# EAGLE schematic reaction_wheel_board (EAGLE 8.4.1)
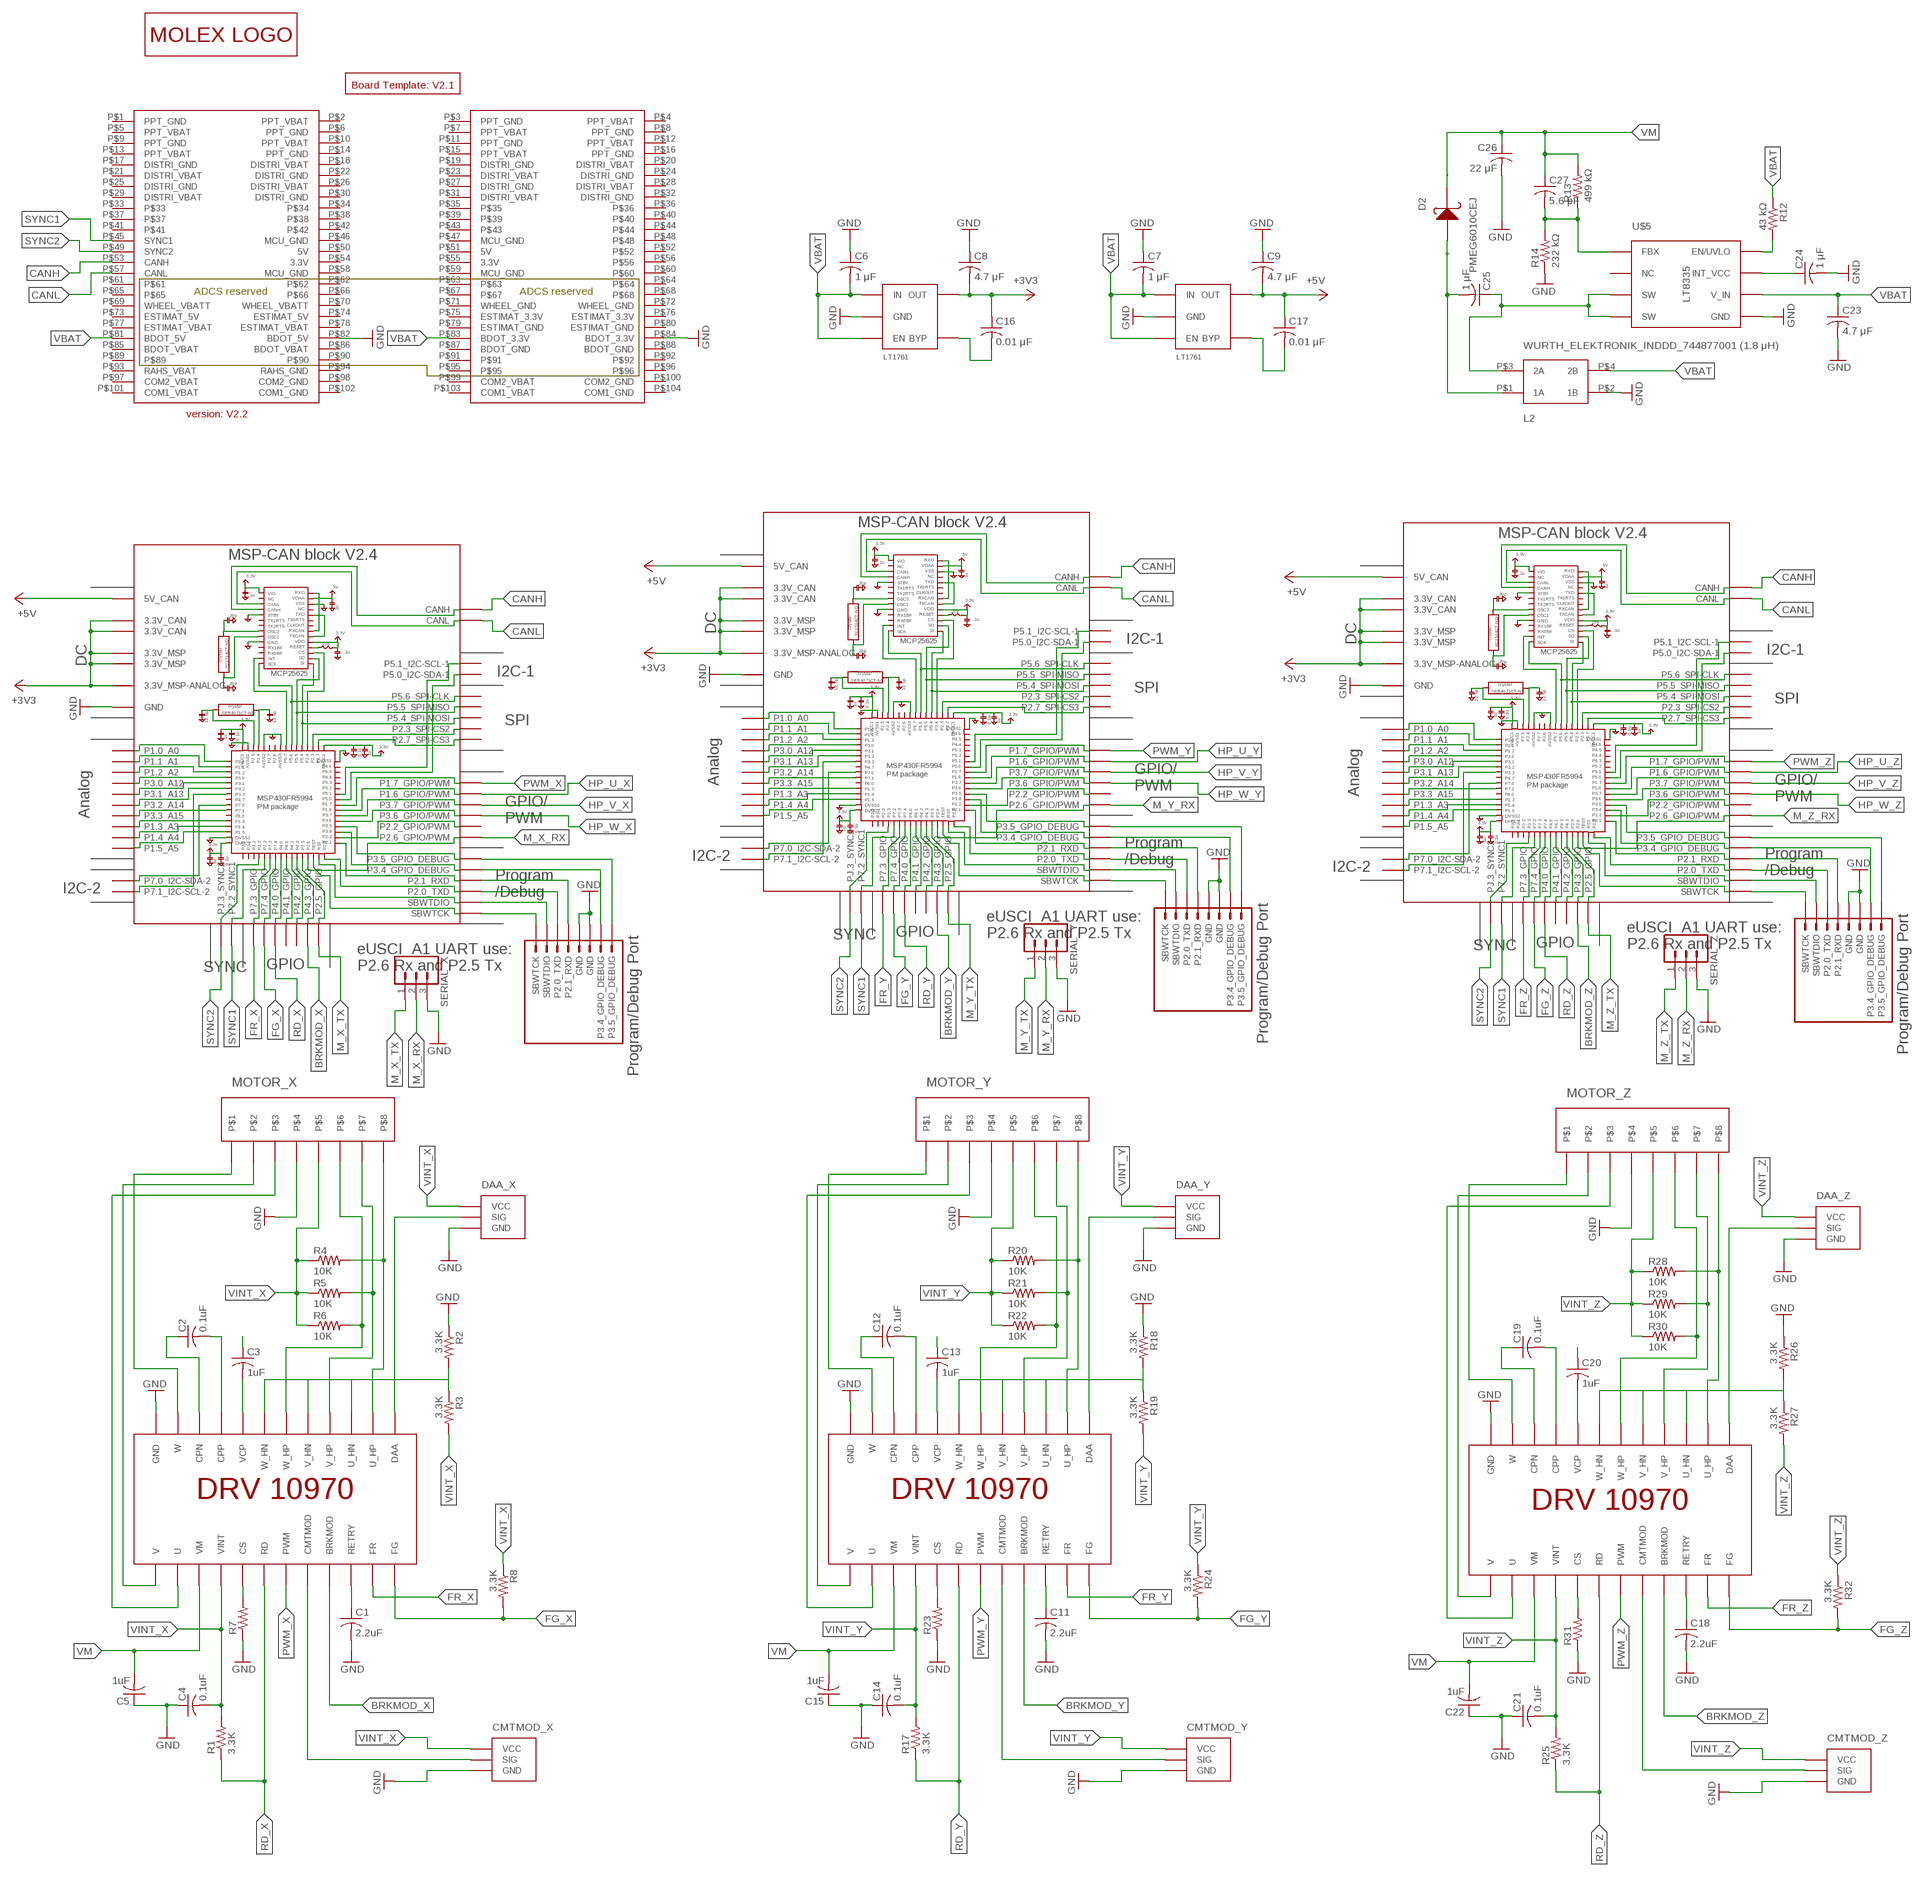
[diagram p0: schematic, sheet 1]

## Parts
C1  2.2uF  C-USC1206  [C1206]
C2  0.1uF  C-USC0805  [C0805]
C3  1uF  C-USC1206  [C1206]
C4  0.1uF  C-USC0805  [C0805]
C5  1uF  C-USC1206  [C1206]
C6  1 μF  C-USC0805  [C0805]
C7  1 μF  C-USC0805  [C0805]
C8  4.7 μF  C-USC0805  [C0805]
C9  4.7 μF  C-USC0805  [C0805]
C11  2.2uF  C-USC1206  [C1206]
C12  0.1uF  C-USC0805  [C0805]
C13  1uF  C-USC1206  [C1206]
C14  0.1uF  C-USC0805  [C0805]
C15  1uF  C-USC1206  [C1206]
C16  0.01 μF  C-USC0805  [C0805]
C17  0.01 μF  C-USC0805  [C0805]
C18  2.2uF  C-USC1206  [C1206]
C19  0.1uF  C-USC0805  [C0805]
C20  1uF  C-USC1206  [C1206]
C21  0.1uF  C-USC0805  [C0805]
C22  1uF  C-USC1206  [C1206]
C23  4.7 μF  C-USC0805  [C0805]
C24  1 μF  C-USC0805  [C0805]
C25  1 μF  C-USC0805  [C0805]
C26  22 μF  C-USC0805  [C0805]
C27  5.6 pF  C-USC0805  [C0805]
CMTMOD_X  0_OHM_JUMPER  [0_OHM_JUMPER]
CMTMOD_Y  0_OHM_JUMPER  [0_OHM_JUMPER]
CMTMOD_Z  0_OHM_JUMPER  [0_OHM_JUMPER]
D2  PMEG6010CEJ  [SC-90]
DAA_X  0_OHM_JUMPER  [0_OHM_JUMPER]
DAA_Y  0_OHM_JUMPER  [0_OHM_JUMPER]
DAA_Z  0_OHM_JUMPER  [0_OHM_JUMPER]
L2  WURTH_ELEKTRONIK_INDDD_744877001 (1.8 μH)  WURTH_ELEKTRONIK_INDDD_744877001  [WURTH_ELEKTRONIK_INDDD_744877001]
LDO_3V3  LINEAR_LDO_LT1761-X  [SOT-23-5]
LDO_5V  LINEAR_LDO_LT1761-X  [SOT-23-5]
MOTOR_X  PICOLOCK_8  [PICOLOCK_8]
MOTOR_Y  PICOLOCK_8  [PICOLOCK_8]
MOTOR_Z  PICOLOCK_8  [PICOLOCK_8]
R1  3.3K  R-US_R0805  [R0805]
R2  3.3K  R-US_R0805  [R0805]
R3  3.3K  R-US_R0805  [R0805]
R4  10K  R-US_R0805  [R0805]
R5  10K  R-US_R0805  [R0805]
R6  10K  R-US_R0805  [R0805]
R7  R-US_R0805  [R0805]
R8  3.3K  R-US_R0805  [R0805]
R12  43 kΩ  R-US_R0805  [R0805]
R13  499 kΩ  R-US_R0805  [R0805]
R14  232 kΩ  R-US_R0805  [R0805]
R17  3.3K  R-US_R0805  [R0805]
R18  3.3K  R-US_R0805  [R0805]
R19  3.3K  R-US_R0805  [R0805]
R20  10K  R-US_R0805  [R0805]
R21  10K  R-US_R0805  [R0805]
R22  10K  R-US_R0805  [R0805]
R23  R-US_R0805  [R0805]
R24  3.3K  R-US_R0805  [R0805]
R25  3.3K  R-US_R0805  [R0805]
R26  3.3K  R-US_R0805  [R0805]
R27  3.3K  R-US_R0805  [R0805]
R28  10K  R-US_R0805  [R0805]
R29  10K  R-US_R0805  [R0805]
R30  10K  R-US_R0805  [R0805]
R31  R-US_R0805  [R0805]
R32  3.3K  R-US_R0805  [R0805]
SERIAL_X  CONN_03LOCK  [1X03_LOCK]
SERIAL_Y  CONN_03LOCK  [1X03_LOCK]
SERIAL_Z  CONN_03LOCK  [1X03_LOCK]
U$1  BOARD_TEMPLATE  [BOARD_TEMPLATE]
U$2  PC104_CONNECTOR  [PC104_CONNECTOR]
U$3  MSP-CAN_BLOCK  [MSP-CAN_BLOCK]
U$4  PROGRAM/DEBUG_PORT  [1X08_CONNECTOR]
U$5  LT8335  [DDB]
U$7  DRV10970  [DRV10970]
U$8  LOGO_MOLEX  [LOGO_MOLEX]
U$10  MSP-CAN_BLOCK  [MSP-CAN_BLOCK]
U$11  PROGRAM/DEBUG_PORT  [1X08_CONNECTOR]
U$12  DRV10970  [DRV10970]
U$13  MSP-CAN_BLOCK  [MSP-CAN_BLOCK]
U$14  PROGRAM/DEBUG_PORT  [1X08_CONNECTOR]
U$15  DRV10970  [DRV10970]

## Nets
+3V3: C8.2 C16.1 LDO_3V3.P$5(OUT) U$3.3.3V@CAN1(3.3V_CAN) U$3.3.3V@CAN2(3.3V_CAN) U$3.3.3V@MSP1(3.3V_MSP) U$3.3.3V@MSP2(3.3V_MSP) U$3.3.3V_ANALOG@MSP2(3.3V_MSP-ANALOG) U$10.3.3V@CAN1(3.3V_CAN) U$10.3.3V@CAN2(3.3V_CAN) U$10.3.3V@MSP1(3.3V_MSP) U$10.3.3V@MSP2(3.3V_MSP) U$10.3.3V_ANALOG@MSP2(3.3V_MSP-ANALOG) U$13.3.3V@CAN1(3.3V_CAN) U$13.3.3V@CAN2(3.3V_CAN) U$13.3.3V@MSP1(3.3V_MSP) U$13.3.3V@MSP2(3.3V_MSP) U$13.3.3V_ANALOG@MSP2(3.3V_MSP-ANALOG)
+5V: C9.2 C17.1 LDO_5V.P$5(OUT) U$3.5V(5V_CAN) U$10.5V(5V_CAN) U$13.5V(5V_CAN)
BRKMOD_X: U$3.P4.3_GPIO U$7.BRKMOD
BRKMOD_Y: U$10.P4.3_GPIO U$12.BRKMOD
BRKMOD_Z: U$13.P4.3_GPIO U$15.BRKMOD
CANH: U$2.P$53(CANH) U$3.CANH U$10.CANH U$13.CANH
CANL: U$2.P$57(CANL) U$3.CANL U$10.CANL U$13.CANL
CMTMOD_X: CMTMOD_X.P$2(SIG) U$7.CMTMOD
CMTMOD_Y: CMTMOD_Y.P$2(SIG) U$12.CMTMOD
CMTMOD_Z: CMTMOD_Z.P$2(SIG) U$15.CMTMOD
CPN_X: C2.1 U$7.CPN
CPN_Y: C12.1 U$12.CPN
CPN_Z: C19.1 U$15.CPN
CPP_X: C2.2 U$7.CPP
CPP_Y: C12.2 U$12.CPP
CPP_Z: C19.2 U$15.CPP
CS_X: R7.2 U$7.CS
CS_Y: R23.2 U$12.CS
CS_Z: R31.2 U$15.CS
DAA_X: DAA_X.P$2(SIG) U$7.DAA
DAA_Y: DAA_Y.P$2(SIG) U$12.DAA
DAA_Z: DAA_Z.P$2(SIG) U$15.DAA
EN_UVLO: R12.2 U$5.P$8(EN/UVLO)
FBX: C27.2 R13.1 R14.2 U$5.P$1(FBX)
FG_X: R8.2 U$3.P7.4_GPIO U$7.FG
FG_Y: R24.2 U$10.P7.4_GPIO U$12.FG
FG_Z: R32.2 U$13.P7.4_GPIO U$15.FG
FR_X: U$3.P7.3_GPIO U$7.FR
FR_Y: U$10.P7.3_GPIO U$12.FR
FR_Z: U$13.P7.3_GPIO U$15.FR
GND: C1.2 C3.1 C4.1 C5.1 C6.1 C7.1 C8.1 C9.1 C11.2 C13.1 C14.1 C15.1 C18.2 C20.1 C21.1 C22.1 C23.2 C24.2 C26.2 CMTMOD_X.P$1(GND) CMTMOD_Y.P$1(GND) CMTMOD_Z.P$1(GND) DAA_X.P$1(GND) DAA_Y.P$1(GND) DAA_Z.P$1(GND) L2.P$2(1B) LDO_3V3.P$2(GND) LDO_5V.P$2(GND) MOTOR_X.P$4 MOTOR_Y.P$4 MOTOR_Z.P$4 R2.1 R7.1 R14.1 R18.1 R23.1 R26.1 R31.1 SERIAL_X.3 SERIAL_Y.3 SERIAL_Z.3 U$2.P$82(BDOT_5V) U$2.P$84(BDOT_3.3V) U$3.GND@1(GND) U$3.GND@2(GND) U$3.GND@3(GND) U$3.GND@4(GND) U$3.GND@5(GND) U$3.GND@7(GND) U$3.GND@8(GND) U$3.GND@9(GND) U$3.GND@10(GND) U$3.GND@11(GND) U$3.GND@12(GND) U$3.GND@13(GND) U$3.GND@14(GND) U$3.GND@15(GND) U$3.GND@16(GND) U$3.GND@17(GND) U$3.GND@26(GND) U$4.5(GND) U$4.6(GND) U$5.GND U$5.P$5(GND) U$7.GND@1(GND) U$7.GND@2(GND) U$10.GND@1(GND) U$10.GND@2(GND) U$10.GND@3(GND) U$10.GND@4(GND) U$10.GND@5(GND) U$10.GND@7(GND) U$10.GND@8(GND) U$10.GND@9(GND) U$10.GND@10(GND) U$10.GND@11(GND) U$10.GND@12(GND) U$10.GND@13(GND) U$10.GND@14(GND) U$10.GND@15(GND) U$10.GND@16(GND) U$10.GND@17(GND) U$10.GND@26(GND) U$11.5(GND) U$11.6(GND) U$12.GND@1(GND) U$12.GND@2(GND) U$13.GND@1(GND) U$13.GND@2(GND) U$13.GND@3(GND) U$13.GND@4(GND) U$13.GND@5(GND) U$13.GND@7(GND) U$13.GND@8(GND) U$13.GND@9(GND) U$13.GND@10(GND) U$13.GND@11(GND) U$13.GND@12(GND) U$13.GND@13(GND) U$13.GND@14(GND) U$13.GND@15(GND) U$13.GND@16(GND) U$13.GND@17(GND) U$13.GND@26(GND) U$14.5(GND) U$14.6(GND) U$15.GND@1(GND) U$15.GND@2(GND)
GPIO_DEBUG_3.4_X: U$3.P3.4_GPIO_DEBUG U$4.7(P3.4_GPIO_DEBUG)
GPIO_DEBUG_3.4_Y: U$10.P3.4_GPIO_DEBUG U$11.7(P3.4_GPIO_DEBUG)
GPIO_DEBUG_3.4_Z: U$13.P3.4_GPIO_DEBUG U$14.7(P3.4_GPIO_DEBUG)
GPIO_DEBUG_3.5_X: U$3.P3.5_GPIO_DEBUG U$4.8(P3.5_GPIO_DEBUG)
GPIO_DEBUG_3.5_Y: U$10.P3.5_GPIO_DEBUG U$11.8(P3.5_GPIO_DEBUG)
GPIO_DEBUG_3.5_Z: U$13.P3.5_GPIO_DEBUG U$14.8(P3.5_GPIO_DEBUG)
HN_X: R2.2 R3.1 U$7.U_HN U$7.V_HN U$7.W_HN
HN_Y: R18.2 R19.1 U$12.U_HN U$12.V_HN U$12.W_HN
HN_Z: R26.2 R27.1 U$15.U_HN U$15.V_HN U$15.W_HN
HP_U_X: MOTOR_X.P$8 R4.2 U$3.P1.6_GPIO/PWM U$7.U_HP
HP_U_Y: MOTOR_Y.P$8 R20.2 U$10.P1.6_GPIO/PWM U$12.U_HP
HP_U_Z: MOTOR_Z.P$8 R28.2 U$13.P1.6_GPIO/PWM U$15.U_HP
HP_V_X: MOTOR_X.P$7 R5.2 U$3.P3.7_GPIO/PWM U$7.V_HP
HP_V_Y: MOTOR_Y.P$7 R21.2 U$10.P3.7_GPIO/PWM U$12.V_HP
HP_V_Z: MOTOR_Z.P$7 R29.2 U$13.P3.7_GPIO/PWM U$15.V_HP
HP_W_X: MOTOR_X.P$6 R6.2 U$3.P3.6_GPIO/PWM U$7.W_HP
HP_W_Y: MOTOR_Y.P$6 R22.2 U$10.P3.6_GPIO/PWM U$12.W_HP
HP_W_Z: MOTOR_Z.P$6 R30.2 U$13.P3.6_GPIO/PWM U$15.W_HP
INT_VCC: C24.1 U$5.P$7(INT_VCC)
M_X_RX: SERIAL_X.2 U$3.P2.6_GPIO/PWM
M_X_TX: SERIAL_X.1 U$3.P2.5_GPIO
M_Y_RX: SERIAL_Y.2 U$10.P2.6_GPIO/PWM
M_Y_TX: SERIAL_Y.1 U$10.P2.5_GPIO
M_Z_RX: SERIAL_Z.2 U$13.P2.6_GPIO/PWM
M_Z_TX: SERIAL_Z.1 U$13.P2.5_GPIO
N$1: C25.2 D2.P$1(+) L2.P$1(1A)
N$13: C17.2 LDO_5V.P$4(BYP)
N$14: C16.2 LDO_3V3.P$4(BYP)
PWM_X: U$3.P1.7_GPIO/PWM U$7.PWM
PWM_Y: U$10.P1.7_GPIO/PWM U$12.PWM
PWM_Z: U$13.P1.7_GPIO/PWM U$15.PWM
RD_X: R1.1 U$3.P4.0_GPIO U$7.RD
RD_Y: R17.1 U$10.P4.0_GPIO U$12.RD
RD_Z: R25.1 U$13.P4.0_GPIO U$15.RD
RETRY_X: C1.1 U$7.RETRY
RETRY_Y: C11.1 U$12.RETRY
RETRY_Z: C18.1 U$15.RETRY
RXD_X: U$3.P2.1_RXD U$4.4(P2.1_RXD)
RXD_Y: U$10.P2.1_RXD U$11.4(P2.1_RXD)
RXD_Z: U$13.P2.1_RXD U$14.4(P2.1_RXD)
SBWTCK_X: U$3.SBWTCK U$4.SBWTCK
SBWTCK_Y: U$10.SBWTCK U$11.SBWTCK
SBWTCK_Z: U$13.SBWTCK U$14.SBWTCK
SBWTDIO_X: U$3.SBWTDIO U$4.2(SBWTDIO)
SBWTDIO_Y: U$10.SBWTDIO U$11.2(SBWTDIO)
SBWTDIO_Z: U$13.SBWTDIO U$14.2(SBWTDIO)
SW: C25.1 L2.P$3(2A) U$5.P$3(SW) U$5.P$4(SW)
SYNC1: U$2.P$45(SYNC1) U$3.P7.2_SYNC1 U$10.P7.2_SYNC1 U$13.P7.2_SYNC1
SYNC2: U$2.P$49(SYNC2) U$3.PJ.3_SYNC2 U$10.PJ.3_SYNC2 U$13.PJ.3_SYNC2
TXD_X: U$3.P2.0_TXD U$4.3(P2.0_TXD)
TXD_Y: U$10.P2.0_TXD U$11.3(P2.0_TXD)
TXD_Z: U$13.P2.0_TXD U$14.3(P2.0_TXD)
U_X: MOTOR_X.P$3 U$7.U
U_Y: MOTOR_Y.P$3 U$12.U
U_Z: MOTOR_Z.P$3 U$15.U
V_X: MOTOR_X.P$2 U$7.V
V_Y: MOTOR_Y.P$2 U$12.V
V_Z: MOTOR_Z.P$2 U$15.V
VBAT: C6.2 C7.2 C23.1 L2.P$4(2B) LDO_3V3.P$1(IN) LDO_3V3.P$3(EN) LDO_5V.P$1(IN) LDO_5V.P$3(EN) R12.1 U$2.P$81(BDOT_5V) U$2.P$83(BDOT_3.3V) U$5.P$6(V_IN)
VCP_X: C3.2 U$7.VCP
VCP_Y: C13.2 U$12.VCP
VCP_Z: C20.2 U$15.VCP
VINT_X: C4.2 CMTMOD_X.P$3(VCC) DAA_X.P$3(VCC) MOTOR_X.P$5 R1.2 R3.2 R4.1 R5.1 R6.1 R8.1 U$7.VINT
VINT_Y: C14.2 CMTMOD_Y.P$3(VCC) DAA_Y.P$3(VCC) MOTOR_Y.P$5 R17.2 R19.2 R20.1 R21.1 R22.1 R24.1 U$12.VINT
VINT_Z: C21.2 CMTMOD_Z.P$3(VCC) DAA_Z.P$3(VCC) MOTOR_Z.P$5 R25.2 R27.2 R28.1 R29.1 R30.1 R32.1 U$15.VINT
VM: C5.2 C15.2 C22.2 C26.1 C27.1 D2.P$2(-) R13.2 U$7.VM U$12.VM U$15.VM
W_X: MOTOR_X.P$1 U$7.W
W_Y: MOTOR_Y.P$1 U$12.W
W_Z: MOTOR_Z.P$1 U$15.W
Unconnected: U$2.P$1(PPT_GND) U$2.P$2(PPT_VBAT) U$2.P$3(PPT_GND) U$2.P$4(PPT_VBAT) U$2.P$5(PPT_VBAT) U$2.P$6(PPT_GND) U$2.P$7(PPT_VBAT) U$2.P$8(PPT_GND) U$2.P$9(PPT_GND) U$2.P$10(PPT_VBAT) U$2.P$11(PPT_GND) U$2.P$12(PPT_VBAT) U$2.P$13(PPT_VBAT) U$2.P$14(PPT_GND) U$2.P$15(PPT_VBAT) U$2.P$16(PPT_GND) U$2.P$17(DISTRI_GND) U$2.P$18(DISTRI_VBAT) U$2.P$19(DISTRI_GND) U$2.P$20(DISTRI_VBAT) U$2.P$21(DISTRI_VBAT) U$2.P$22(DISTRI_GND) U$2.P$23(DISTRI_VBAT) U$2.P$24(DISTRI_GND) U$2.P$25(DISTRI_GND) U$2.P$26(DISTRI_VBAT) U$2.P$27(DISTRI_GND) U$2.P$28(DISTRI_VBAT) U$2.P$29(DISTRI_VBAT) U$2.P$30(DISTRI_GND) U$2.P$31(DISTRI_VBAT) U$2.P$32(DISTRI_GND) U$2.P$33 U$2.P$34 U$2.P$35 U$2.P$36 U$2.P$37 U$2.P$38 U$2.P$39 U$2.P$40 U$2.P$41 U$2.P$42 U$2.P$43 U$2.P$44 U$2.P$46(MCU_GND) U$2.P$47(MCU_GND) U$2.P$48 U$2.P$50(5V) U$2.P$51(5V) U$2.P$52 U$2.P$54(3.3V) U$2.P$55(3.3V) U$2.P$56 U$2.P$58(MCU_GND) U$2.P$59(MCU_GND) U$2.P$60 U$2.P$61 U$2.P$62 U$2.P$63 U$2.P$64 U$2.P$65 U$2.P$66 U$2.P$67 U$2.P$68 U$2.P$69(WHEEL_VBATT) U$2.P$70(WHEEL_VBATT) U$2.P$71(WHEEL_GND) U$2.P$72(WHEEL_GND) U$2.P$73(ESTIMAT_5V) U$2.P$74(ESTIMAT_5V) U$2.P$75(ESTIMAT_3.3V) U$2.P$76(ESTIMAT_3.3V) U$2.P$77(ESTIMAT_VBAT) U$2.P$78(ESTIMAT_VBAT) U$2.P$79(ESTIMAT_GND) U$2.P$80(ESTIMAT_GND) U$2.P$85(BDOT_VBAT) U$2.P$86(BDOT_VBAT) U$2.P$87(BDOT_GND) U$2.P$88(BDOT_GND) U$2.P$89 U$2.P$90 U$2.P$91 U$2.P$92 U$2.P$93(RAHS_VBAT) U$2.P$94(RAHS_GND) U$2.P$95 U$2.P$96 U$2.P$97(COM2_VBAT) U$2.P$98(COM2_GND) U$2.P$99(COM2_VBAT) U$2.P$100(COM2_GND) U$2.P$101(COM1_VBAT) U$2.P$102(COM1_GND) U$2.P$103(COM1_VBAT) U$2.P$104(COM1_GND) U$3.P1.0_A0 U$3.P1.1_A1 U$3.P1.2_A2 U$3.P1.3_A3 U$3.P1.4_A4 U$3.P1.5_A5 U$3.P2.2_GPIO/PWM U$3.P2.4_SPI-CS2(P2.3_SPI-CS2) U$3.P2.7_SPI-CS3 U$3.P3.0_A12 U$3.P3.1_A13 U$3.P3.2_A14 U$3.P3.3_A15 U$3.P4.1_GPIO U$3.P4.2_GPIO U$3.P5.0_I2C-SDA-1 U$3.P5.1_I2C-SCL-1 U$3.P5.4_SPI-MOSI U$3.P5.5_SPI-MISO U$3.P5.6_SPI-CLK U$3.P7.0_I2C-SDA-2 U$3.P7.1_I2C-SCL-2 U$5.P$2(NC) U$10.P1.0_A0 U$10.P1.1_A1 U$10.P1.2_A2 U$10.P1.3_A3 U$10.P1.4_A4 U$10.P1.5_A5 U$10.P2.2_GPIO/PWM U$10.P2.4_SPI-CS2(P2.3_SPI-CS2) U$10.P2.7_SPI-CS3 U$10.P3.0_A12 U$10.P3.1_A13 U$10.P3.2_A14 U$10.P3.3_A15 U$10.P4.1_GPIO U$10.P4.2_GPIO U$10.P5.0_I2C-SDA-1 U$10.P5.1_I2C-SCL-1 U$10.P5.4_SPI-MOSI U$10.P5.5_SPI-MISO U$10.P5.6_SPI-CLK U$10.P7.0_I2C-SDA-2 U$10.P7.1_I2C-SCL-2 U$13.P1.0_A0 U$13.P1.1_A1 U$13.P1.2_A2 U$13.P1.3_A3 U$13.P1.4_A4 U$13.P1.5_A5 U$13.P2.2_GPIO/PWM U$13.P2.4_SPI-CS2(P2.3_SPI-CS2) U$13.P2.7_SPI-CS3 U$13.P3.0_A12 U$13.P3.1_A13 U$13.P3.2_A14 U$13.P3.3_A15 U$13.P4.1_GPIO U$13.P4.2_GPIO U$13.P5.0_I2C-SDA-1 U$13.P5.1_I2C-SCL-1 U$13.P5.4_SPI-MOSI U$13.P5.5_SPI-MISO U$13.P5.6_SPI-CLK U$13.P7.0_I2C-SDA-2 U$13.P7.1_I2C-SCL-2

## Library data of the parts
C1-C9 C11-C27 = rcl:C-US: CAPACITOR, American symbol
CMTMOD_X CMTMOD_Y CMTMOD_Z DAA_X DAA_Y DAA_Z = DubSat1 Components:0_OHM_JUMPER
D2 = DubSat1 Components:PMEG6010CEJ
L2 = DubSat1 Components:WURTH_ELEKTRONIK_INDDD_744877001
LDO_3V3 LDO_5V = DubSat1 Components:LINEAR_LDO_LT1761-X
MOTOR_X MOTOR_Y MOTOR_Z = DubSat1 Components:PICOLOCK_8
R1-R8 R12-R14 R17-R32 = rcl:R-US_: RESISTOR, American symbol
SERIAL_X SERIAL_Y SERIAL_Z = SparkFun-Connectors:CONN_03: Multi connection point. Often used as Generic Header-pin footprint for 0.1 inch spaced/style header connections On any of the 0.1 inch spaced packages, you can populate with these: Break Away Headers - Straight <https://www.sparkfun.com/products/116> (PRT-00116) Break Away Male Headers - Right Angle <https://www.sparkfun.com/products/553> (PRT-00553) Female Headers <https://www.sparkfun.com/products/115> (PRT-00115) Break Away Headers - Machine Pin <https://www.sparkfun.com/products/117> (PRT-00117) Break Away Female Headers - Swiss Machine Pin <https://www.sparkfun.com/products/743> (PRT-00743) Stackable Header - 3 Pin (Female, 0.1") <https://www.sparkfun.com/products/13875> (PRT-13875) For SCREWTERMINALS and SPRING TERMINALS visit here: Screw Terimnals on SparkFun.com <https://www.sparkfun.com/search/results?term=Screw+Terminals> (5mm/3.5mm/2.54mm spacing) This device is also useful as a general connection point to wire up your design to another part of your project. Our various solder wires solder well into these plated through hole pads. Hook-Up Wire - Assortment (Stranded, 22 AWG) <https://www.sparkfun.com/products/11375> (PRT-11375) Hook-Up Wire - Assortment (Solid Core, 22 AWG) <https://www.sparkfun.com/products/11367> (PRT-11367) View the entire wire category on our website here <https://www.sparkfun.com/categories/141> Special notes: Molex polarized connector foot print use with SKU : PRT-08232 with associated crimp pins and housings.
U$1 = DubSat1 Components:BOARD_TEMPLATE
U$2 = DubSat1 Components:PC104_CONNECTOR
U$3 U$10 U$13 = DubSat1 Components:MSP-CAN_BLOCK
U$4 U$11 U$14 = DubSat1 Components:PROGRAM/DEBUG_PORT
U$5 = DubSat1 Components:LT8335
U$7 U$12 U$15 = DubSat1 Components:DRV10970
U$8 = HuskySat-1 Logos:LOGO_MOLEX

## Net classes
0 default: width 0.254 mm, drill 0.254 mm, clearance 0.152 mm